# EAGLE schematic Status Board 0.1 7 seg matrix templet (EAGLE 8.5.2)
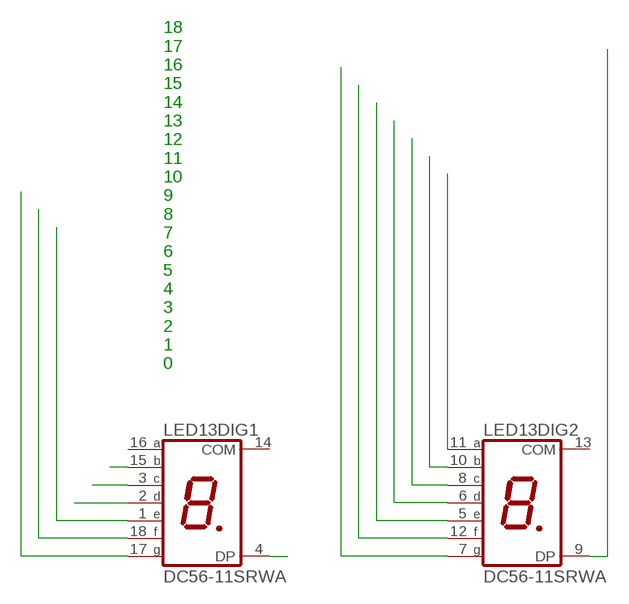
[diagram p0: schematic, sheet 1]

## Parts
LED13  DC56-11SRWA  [DA56]

## Nets
N$41: LED13.15(DIG1:B)
N$42: LED13.3(DIG1:C)
N$43: LED13.2(DIG1:D)
N$44: LED13.4(DIG1:DP)
N$45: LED13.1(DIG1:E)
N$46: LED13.18(DIG1:F)
N$47: LED13.17(DIG1:G)
N$48: LED13.11(DIG2:A)
N$49: LED13.10(DIG2:B)
N$50: LED13.6(DIG2:D)
N$51: LED13.5(DIG2:E)
N$52: LED13.12(DIG2:F)
N$53: LED13.7(DIG2:G)
N$54: LED13.9(DIG2:DP)
N$55: LED13.8(DIG2:C)
Unconnected: LED13.13(DIG2:COM) LED13.14(DIG1:COM) LED13.16(DIG1:A)

## Notes on the sheet
- 18
  17
  16
  15
  14
  13
  12
  11
  10
  9
  8
  7
  6
  5
  4
  3
  2
  1
  0

## Library data of the parts
LED13 = display-kingbright:DC56-11: 14.22mm (0.56INCH) DUAL DIGIT NUMERIC DISPLAYS Source: www.kingbright.com .. DA56-11SRWA.pdf; OC_FARNELL: unknown; OC_NEWARK: unknown